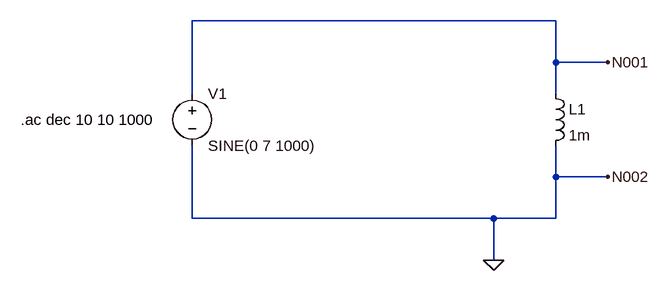
[diagram p0: schematic LAB02 - Task 3.1.asc]
LAB02 - Task 3.1.asc, the LTspice schematic file:
Version 4
SHEET 1 880 680
WIRE 640 192 80 192
WIRE 640 256 640 192
WIRE 720 256 640 256
WIRE 80 304 80 192
WIRE 640 304 640 256
WIRE 640 432 640 384
WIRE 720 432 640 432
WIRE 80 496 80 384
WIRE 544 496 80 496
WIRE 640 496 640 432
WIRE 640 496 544 496
WIRE 544 560 544 496
FLAG 544 560 0
FLAG 720 256 N001
FLAG 720 432 N002
SYMBOL voltage 80 288 R0
SYMATTR InstName V1
SYMATTR Value SINE(0 7 1000)
SYMBOL ind 624 288 R0
SYMATTR InstName L1
SYMATTR Value 1m
TEXT -184 344 Left 2 !.ac dec 10 10 1000

The netlist it stands for:
* LAB02 - Task 3.1.asc
V1 N001 0 SINE(0 7 1000)
L1 N001 0 1m
.ac dec 10 10 1000
.backanno
.end